# Altium schematic sheet Sensors.SchDoc
size A3; SheetNumber: 2; SheetTotal: 5
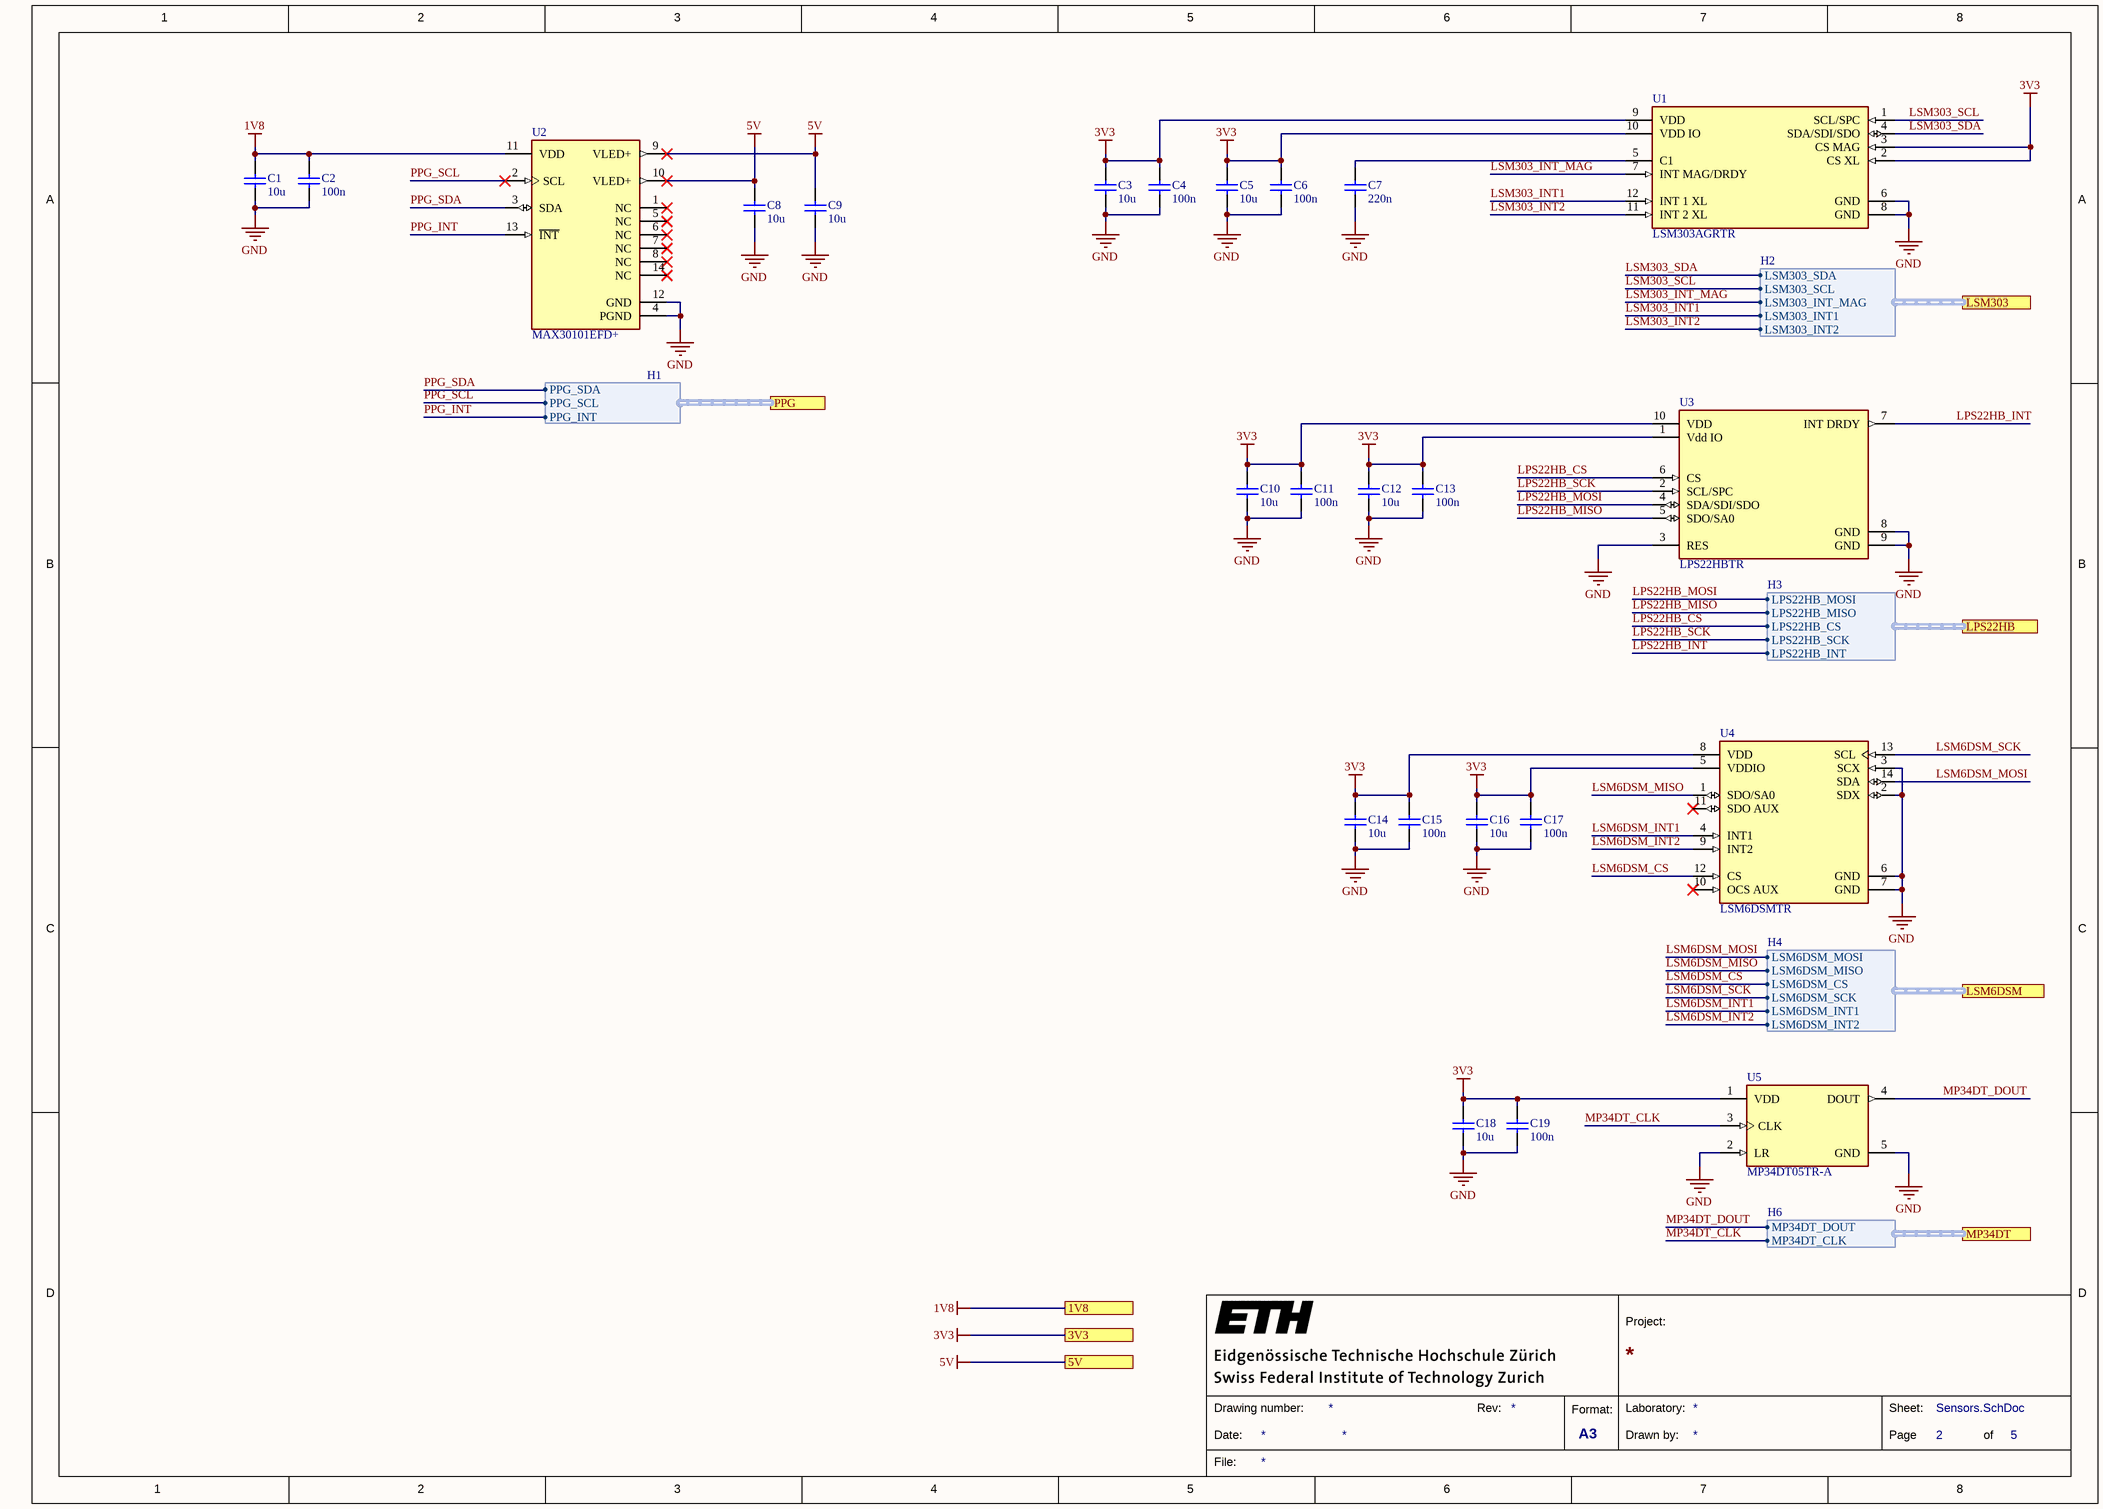
[diagram p0: Sensors.SchDoc]

## Parts
C1  10u  [CAPC1005X70X10NL05]
C2  100n  [CAPC1005X60X30ML05T10]
C3  10u  [CAPC1005X70X10NL05]
C4  100n  [CAPC1005X60X30ML05T10]
C5  10u  [CAPC1005X70X10NL05]
C6  100n  [CAPC1005X60X30ML05T10]
C7  220n  [CAPC1005X55X25ML05T10]
C8  10u  [CAPC1005X70X10NL05]
C9  10u  [CAPC1005X70X10NL05]
C10  10u  [CAPC1005X70X10NL05]
C11  100n  [CAPC1005X60X30ML05T10]
C12  10u  [CAPC1005X70X10NL05]
C13  100n  [CAPC1005X60X30ML05T10]
C14  10u  [CAPC1005X70X10NL05]
C15  100n  [CAPC1005X60X30ML05T10]
C16  10u  [CAPC1005X70X10NL05]
C17  100n  [CAPC1005X60X30ML05T10]
C18  10u  [CAPC1005X70X10NL05]
C19  100n  [CAPC1005X60X30ML05T10]
U1  LSM303AGRTR  [FP-LGA-12-8487206-MFG]
U2  MAX30101EFD+  [FP-F143A5-1-MFG]
U3  LPS22HBTR  [FP-HLGA-10L-8479831-0]
U4  LSM6DSMTR  [FP-LGA-14L-DM00249496-MFG]
U5  MP34DT05TR-A  [FP-HCLGA-DM00231908-MFG]

## Ports
1V8, 3V3, 5V, LPS22HB (harness H3), LSM6DSM (harness H4), LSM303 (harness H2), MP34DT (harness H6), PPG (harness H1)

## Harnesses
H2: LSM303_SDA, LSM303_SCL, LSM303_INT_MAG, LSM303_INT1, LSM303_INT2
H3: LPS22HB_MOSI, LPS22HB_MISO, LPS22HB_CS, LPS22HB_SCK, LPS22HB_INT
H4: LSM6DSM_MOSI, LSM6DSM_MISO, LSM6DSM_CS, LSM6DSM_SCK, LSM6DSM_INT1, LSM6DSM_INT2
H6: MP34DT_DOUT, MP34DT_CLK
H1: PPG_SDA, PPG_SCL, PPG_INT

## Nets
1V8: C1.2 C2.2 U2.11(VDD) ; port 1V8
3V3: C3.2 C4.2 C5.2 C6.2 C10.2 C11.2 C12.2 C13.2 C14.2 C15.2 C16.2 C17.2 C18.2 C19.2 U1.2(CS_XL) U1.3(CS_MAG) U1.9(VDD) U1.10(VDD_IO) U3.1(Vdd_IO) U3.10(VDD) U4.5(VDDIO) U4.8(VDD) U5.1(VDD) ; port 3V3
5V: C8.2 C9.2 U2.9(VLED+) U2.10(VLED+) ; port 5V
GND: C1.1 C2.1 C3.1 C4.1 C5.1 C6.1 C7.1 C8.1 C9.1 C10.1 C11.1 C12.1 C13.1 C14.1 C15.1 C16.1 C17.1 C18.1 C19.1 U1.6(GND) U1.8(GND) U2.4(PGND) U2.12(GND) U3.3(RES) U3.8(GND) U3.9(GND) U4.2(SDX) U4.3(SCX) U4.6(GND) U4.7(GND) U5.2(LR) U5.5(GND)
LPS22HB_CS: U3.6(CS) ; port LPS22HB.LPS22HB_CS
LPS22HB_INT: U3.7(INT_DRDY) ; port LPS22HB.LPS22HB_INT
LPS22HB_MISO: U3.5(SDO/SA0) ; port LPS22HB.LPS22HB_MISO
LPS22HB_MOSI: U3.4(SDA/SDI/SDO) ; port LPS22HB.LPS22HB_MOSI
LPS22HB_SCK: U3.2(SCL/SPC) ; port LPS22HB.LPS22HB_SCK
LSM6DSM_CS: U4.12(CS) ; port LSM6DSM.LSM6DSM_CS
LSM6DSM_INT1: U4.4(INT1) ; port LSM6DSM.LSM6DSM_INT1
LSM6DSM_INT2: U4.9(INT2) ; port LSM6DSM.LSM6DSM_INT2
LSM6DSM_MISO: U4.1(SDO/SA0) ; port LSM6DSM.LSM6DSM_MISO
LSM6DSM_MOSI: U4.14(SDA) ; port LSM6DSM.LSM6DSM_MOSI
LSM6DSM_SCK: U4.13(SCL) ; port LSM6DSM.LSM6DSM_SCK
LSM303_INT1: U1.12(INT_1_XL) ; port LSM303.LSM303_INT1
LSM303_INT2: U1.11(INT_2_XL) ; port LSM303.LSM303_INT2
LSM303_INT_MAG: U1.7(INT_MAG/DRDY) ; port LSM303.LSM303_INT_MAG
LSM303_SCL: U1.1(SCL/SPC) ; port LSM303.LSM303_SCL
LSM303_SDA: U1.4(SDA/SDI/SDO) ; port LSM303.LSM303_SDA
MP34DT_CLK: U5.3(CLK) ; port MP34DT.MP34DT_CLK
MP34DT_DOUT: U5.4(DOUT) ; port MP34DT.MP34DT_DOUT
PPG_INT: U2.13(~{INT}) ; port PPG.PPG_INT
PPG_SCL: U2.2(SCL) ; port PPG.PPG_SCL
PPG_SDA: U2.3(SDA) ; port PPG.PPG_SDA
NetC7_2: C7.2 U1.5(C1)

Not connected (* = marked no-connect by the designer): U2 1(NC)* 5(NC)* 6(NC)* 7(NC)* 8(NC)* 14(NC)*; U4 10(OCS_AUX)* 11(SDO_AUX)*

## Notes on the sheet
- 1
- 2
- 3
- 4
- 5
- 6
- 7
- 8
- A
- B
- C
- D
- Project:
- Date:
- Drawing number:
- Rev:
- Format:
- A3
- Drawn by:
- Laboratory:
- Page
- Sheet:
- of
- File:

## Library data of the parts
C1 C3 C5 C8-C10 C12 C14 C16 C18 = CMP-2000-05993-1: Chip Capacitor, 10 uF, +/- 20%, -55 to 85 degC, 0402 (1005 Metric), RoHS, Tape and Reel; PCN Part Number: MLCCPartNumberChange30/Nov/2012; Manufacturer: TDK; Voltage - Rated: 6.3V; Capacitance: 10µF; Product Training Modules: CSeriesGeneralApplicationsSEAT,CCV,andTVCLDesignToolsGuidetoReplacinganElectrolyticCapacitorwithanMLCC; Online Catalog: CSeries,GeneralPurpose; Kits: 445-9021-KIT-ND-KITMLCC100PF-10UF04026.3-50V445-9003-KIT-ND-KITCAPCERHICAPMLCCSMD; Temperature Coefficient: X5R; Other Names: 445-8920-1; Standard Package: 1; Datasheet URL: http://download.siliconexpert.com/pdfs/2015/4/21/15/54/45/779/tdk_/manual/37024850441143360mlcc_commercial_general_en.pdf; Package Description: 2-Pin Surface Mount Device, Body 1.00 x 0.50 mm; Lead Style: -; RoHS Information: RoHSCertificate-MLCC; Mounting Technology: SurfaceMount; Manufacturer URL: http://www.tdk.com/; Packaging: CutTape(CT); Series: C; Category: Capacitors; Operating Temperature: -55°C~85°C; Ratings: -; Applications: GeneralPurpose; Lead Spacing: -; Family: CeramicCapacitors; Mounting Type: SurfaceMount,MLCC; Package / Case: 0402(1005Metric); Features: -; Thickness (Max): 0.020"(0.50mm); Size / Dimension: 0.039"Lx0.020"W(1.00mmx0.50mm); Datasheet Version: 03/2015; Package Reference: 0402; Tolerance: ±20%; Height - Seated (Max): -
C2 C4 C6 C11 C13 C15 C17 C19 = CMP-2008-02046-1: Manufacturer: Kemet; Part Number: C0402C104K8PACTU
C7 = CMP-2000-05010-1: Chip Capacitor, 220 nF, +/- 10%, 16 V, -55 to 125 degC, 0402 (1005 Metric), RoHS, Tape and Reel; Manufacturer: Murata; Dielectric: C0G; Rated Voltage: 16V; Capacitance: 0.22µF; Datasheet Version: Oct-14; Tolerance (%): ±10%; Case Size/Dimension: 0402; Package Description: 2-Pin Surface Mount Device, Body 1 x 0.5 mm; Datasheet URL: https://datasheet.ciiva.com/132/product-132672.pdf; Package Reference: 402; Manufacturer URL: http://www.murata.com/
U1 = CMP-12177-000005-1: IMU ACCEL/MAG I2C/SPI 12LGA; Manufacturer: STMicroelectronics; Accel Range: 2/4/8/16g; Operating Supply Current: 3.7-200uA; Sensor Output: I2C,SPI; Accel Resolution: 16bits; Max Supply Voltage: 3.6V; Min Supply Voltage: 1.71V; Mag Sense Range: 49.152gauss (g); Sensor Type: Temperature,Accelerometer,Magnetometer; Mouser Description: IMUs - Inertial Measurement Units Ultra-compact high-performance e-compass 3D accelerometer and 3D magnetometer module; Temperature Range High: +85°C; Package: LGA-12-8487206; Manufacturer Part Number: LSM303AGRTR; Category: IC; Device Class L3: Inertial Measurement Units (IMUs); Temperature: -40°C to +85°C; Device Class L2: Motion Sensors; ComponentLink2Description: Datasheet; Octopart: https://octopart.com/lsm303agrtr-stmicroelectronics-59386630; Automotive: No; Device Class L1: Sensors; Resolution: 16bits; RoHS: TRUE; Height: 1mm; ComponentLink2URL: https://www.st.com/resource/en/datasheet/lsm303agr.pdf; Lead Free: Yes; Temperature Range Low: -40°C; Footprint Url: https://www.st.com/content/ccc/resource/technical/document/technical_note/73/17/9c/16/dd/96/4a/01/CD00134799.pdf/files/CD00134799.pdf/jcr:content/translations/en.CD00134799.pdf; Digikey Description: IMU ACCEL/MAG I2C/SPI 12LGA
U2 = CMP-05738-000001-1: INTEGRATED OPTICAL SENSOR; Manufacturer: Maxim Integrated; Max Supply Voltage: 2V; Max Junction Temp: +90°C; Operating Supply Current: 600uA; Min Supply Voltage: 1.7V; Sensor Output: I2C; RoHS: TRUE; Footprint Url: https://pdfserv.maximintegrated.com/land_patterns/90-0602.PDF; Manufacturer Part Number: MAX30101EFD+; Device Class L2: unset; Temperature Range Low: -40°C; Automotive: No; Height: 1.65mm; Temperature Range High: +85°C; ComponentLink2Description: Datasheet; Mouser Description: INTEGRATED OPTICAL SENSOR; ComponentLink2URL: https://datasheets.maximintegrated.com/en/ds/MAX30101.pdf; Octopart: https://octopart.com/max30101efd%2B-maxim+integrated-57054333; Temperature: -40°C to +85°C; Package: F143A5-1; Lead Free: Yes; Device Class L1: Sensors; Digikey Description: INTEGRATED OPTICAL SENSOR; Category: IC; Device Class L3: unset
U3 = CMP-12182-000004-1: MEMS NANO PRESSURE SENSOR: 260-1; Manufacturer: STMicroelectronics; Sensor Output: I2C,SPI; Port Style: No Port; Max Supply Voltage: 3.6V; Operating Supply Current: 3-12uA; Min Supply Voltage: 1.7V; Device Class L3: unset; Device Class L1: Sensors; Manufacturer Part Number: LPS22HBTR; Temperature Range High: +85°C; Digikey Description: MEMS NANO PRESSURE SENSOR: 260-1; Device Class L2: Pressure Sensors; RoHS: TRUE; Lead Free: Yes; Height: 0.8mm; Automotive: No; Octopart: https://octopart.com/lps22hbtr-stmicroelectronics-51851131; Package: HLGA-10L-8479831; Temperature Range Low: -40°C; Category: IC; Temperature: -40°C to +85°C; ComponentLink2Description: Datasheet; ComponentLink2URL: https://www.st.com/resource/en/datasheet/lps22hb.pdf; Footprint Url: https://www.st.com/content/ccc/resource/technical/document/technical_note/73/17/9c/16/dd/96/4a/01/CD00134799.pdf/files/CD00134799.pdf/jcr:content/translations/en.CD00134799.pdf
U4 = CMP-12177-000008-1: IMU ACCEL/GYRO I2C/SPI 14LGA; Manufacturer: STMicroelectronics; Operating Supply Current: 0.29-0.65mA; Gyro Range: 125/250/500/1000/2000°/s; Sensor Output: I2C,SPI; Accel Range: 2/4/8/16g; Min Supply Voltage: 1.62V; Resolution: 16bits; Sensor Type: Temperature,Accelerometer,Gyroscope; Max Supply Voltage: 3.6V; Manufacturer Part Number: LSM6DSMTR; Octopart: https://octopart.com/lsm6dsmtr-stmicroelectronics-66358194; Height: 0.86mm; Category: IC; Lead Free: Yes; Temperature: -40°C to +85°C; Temperature Range Low: -40°C; ComponentLink2Description: Datasheet; ComponentLink2URL: https://www.st.com/resource/en/datasheet/lsm6dsm.pdf; Digikey Description: IMU ACCEL/GYRO I2C/SPI 14LGA; Footprint Url: https://www.st.com/content/ccc/resource/technical/document/technical_note/73/17/9c/16/dd/96/4a/01/CD00134799.pdf/files/CD00134799.pdf/jcr:content/translations/en.CD00134799.pdf; Device Class L1: Sensors; Device Class L2: Motion Sensors; Temperature Range High: +85°C; Mouser Description: LSM6DSM Series 3.6 V I2C/SPI 3D Accelerometer and 3D Gyroscope - LGA-14; Device Class L3: Inertial Measurement Units (IMUs); Automotive: No; Package: LGA-14L-DM00249496; RoHS: TRUE
U5 = CMP-12231-000001-1: MEMS AUD MIC SENSOR OMNI 4HCLGA; Manufacturer: STMicroelectronics; Min Supply Voltage: 1.6V; Max Supply Voltage: 3.6V; Operating Supply Voltage: 1.8V; Frequency: 2.4MHz; Direction: Omidirectional; Current: 650uA; Lead Free: Yes; Digikey Description: MEMS AUD MIC SENSOR OMNI 4HCLGA; Device Class L1: Electromechanical; ComponentLink2Description: Datasheet; RoHS: TRUE; Temperature: -40°C to +85°C; Package: HCLGA-DM00231908; Device Class L2: Audio Products; Device Class L3: Microphones; Manufacturer Part Number: MP34DT05TR-A; Mouser Description: MP34DT05: 3.6 V MEMS Audio Sensor Omnidirectional Digital Microphone - HCLGA-4LD; Temperature Range Low: -40°C; ComponentLink2URL: https://www.st.com/resource/en/datasheet/mp34dt05-a.pdf; Octopart: https://octopart.com/mp34dt05tr-a-stmicroelectronics-87879016; Automotive: No; Height: 1.1mm; Temperature Range High: +85°C; Category: IC